# EAGLE design USB_SAO (EAGLE 9.3.1)
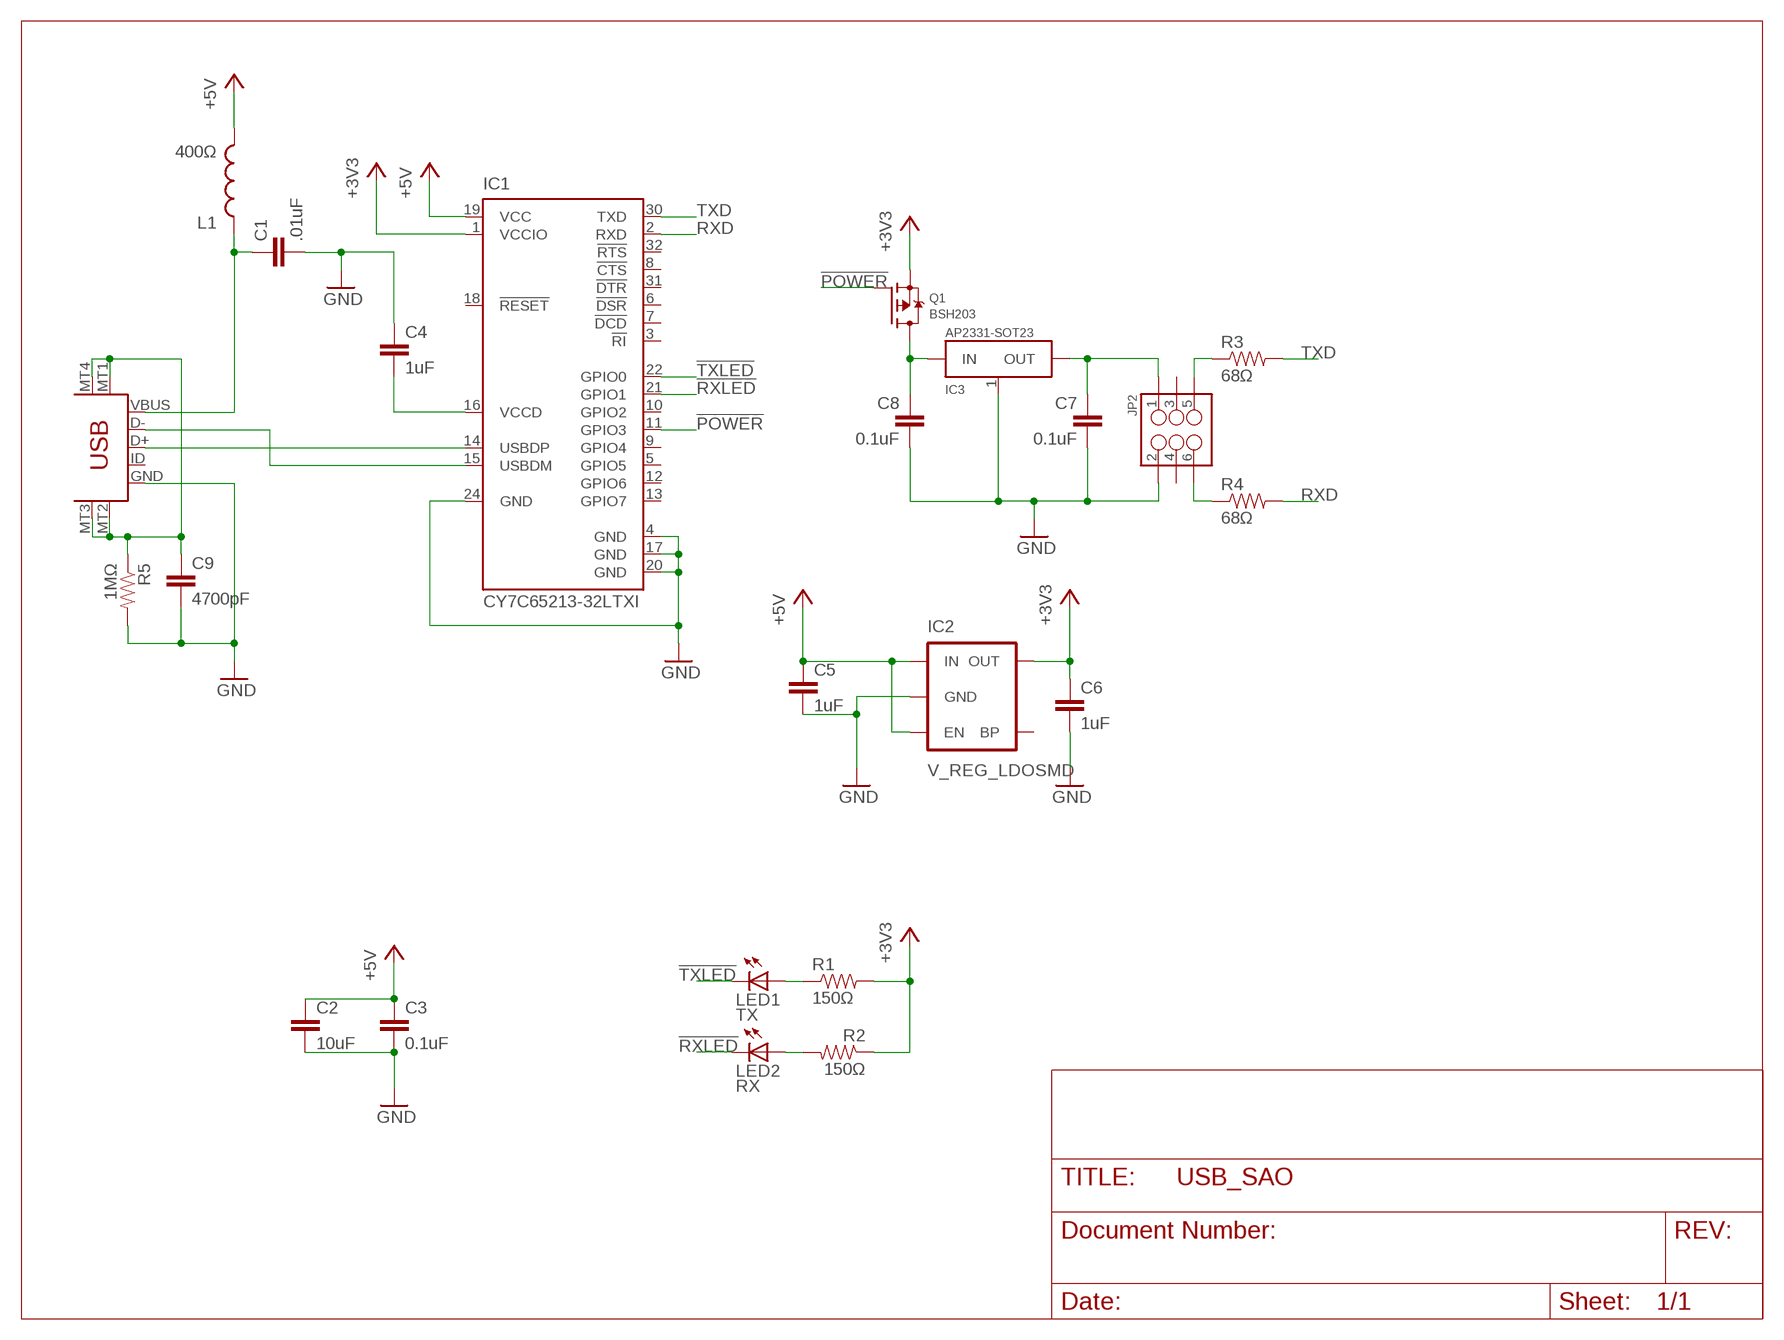
[diagram p0: schematic, sheet 1]

## Parts
C1  .01uF  CAP0805  [0805]
C2  10uF  CAP0805  [0805]
C3  0.1uF  CAP0805  [0805]
C4  1uF  CAP0805  [0805]
C5  1uF  CAP0805  [0805]
C6  1uF  CAP0805  [0805]
C7  0.1uF  CAP0805  [0805]
C8  0.1uF  CAP0805  [0805]
C9  4700pF  CAP0805  [0805]
IC1  CY7C65213-32LTXI  [QFN32]
IC2  V_REG_LDOSMD  [SOT23-5]
IC3  AP2331-SOT23  [SOT23-3]
JP1  USB-5PIN-MICROB  [USB-MICROB]
JP2  M03X2NO_SILK  [2X3-NS]
L1  400Ω  INDUCTOR0805  [0805]
LED1  TX  LEDCHIP-LED0805  [CHIP-LED0805]
LED2  RX  LEDCHIP-LED0805  [CHIP-LED0805]
Q1  BSH203  MOSFET-P  [SOT23-R]
R1  150Ω  RESISTOR0805-RES  [0805]
R2  150Ω  RESISTOR0805-RES  [0805]
R3  68Ω  RESISTOR0805-RES  [0805]
R4  68Ω  RESISTOR0805-RES  [0805]
R5  1MΩ  RESISTOR0805-RES  [0805]

## Nets
!POWER: IC1.11(GPIO3) Q1.1(G)
!RXLED: IC1.21(GPIO1) LED2.C
!TXLED: IC1.22(GPIO0) LED1.C
+3V3: C6.1 IC1.1(VCCIO) IC2.5(OUT) Q1.2(S) R1.2 R2.1
+5V: C2.1 C3.1 C5.1 IC1.19(VCC) IC2.1(IN) IC2.3(EN) L1.2
GND: C1.2 C2.2 C3.2 C4.1 C5.2 C6.2 C7.2 C8.2 C9.2 IC1.4(GND) IC1.17(GND) IC1.20(GND) IC1.24(GND) IC2.2(GND) IC3.1(GND) JP1.GND JP2.2 R5.2
N$1: IC1.14(USBDP) JP1.D+
N$2: IC1.15(USBDM) JP1.D-
N$3: LED1.A R1.1
N$4: LED2.A R2.2
N$5: JP2.5 R3.1
N$6: C1.1 JP1.VBUS L1.1
N$7: JP2.6 R4.1
N$9: C7.1 IC3.2(OUT) JP2.1
N$10: C8.1 IC3.3(IN) Q1.3(D)
N$11: C9.1 JP1.MT1(MTN1) JP1.MT2(MTN3) JP1.MT3(MTN4) JP1.MT4(MTN2) R5.1
N$17: C4.2 IC1.16(VCCD)
RXD: IC1.2(RXD) R4.2
TXD: IC1.30(TXD) R3.2
Unconnected: IC1.3(!RI) IC1.5(GPIO5) IC1.6(!DSR) IC1.7(!DCD) IC1.8(!CTS) IC1.9(GPIO4) IC1.10(GPIO2) IC1.12(GPIO6) IC1.13(GPIO7) IC1.18(!RESET) IC1.31(!DTR) IC1.32(!RTS) IC2.4(BP) JP1.ID JP2.3 JP2.4

## Library data of the parts
C1-C9 = SparkFun-Capacitors:CAP: Capacitor Standard 0603 ceramic capacitor, and 0.1" leaded capacitor.
IC1 = ftdichip:CY7C65213-32LTXI
IC2 = SparkFun-PowerIC:V_REG_LDO: Voltage Regulator LDO Standard 150mA LDO voltage regulator in SOT-23 layout. Micrel part MIC5205. BP (by-pass) pin is used to lower output noise with 470pF cap.
IC3 = AP2331:AP2331-SOT23
JP1 = SparkFun-Connectors:USB-5PIN: Mini-USB "B" connector with 5th pin broken out. Created new symbol breaking out 5th "ID" pin in mini/micro USB connector spec. See: http://en.wikipedia.org/wiki/Mini_usb#Cables. Uses same footprint as 4-pin symbol. Also added pins to connect to mounting / shield pads if required (probably not generally needed as signals aren't shielded once they leave the connector).
JP2 = SparkFun-Connectors-new:M03X2: 2x3 .1" header. Shrouded, with keying- CONN-10681 SMT- CONN-11415 Pogo pins- HW-11044
L1 = SparkFun-Passives:INDUCTOR: Inductors Basic Inductor/Choke - 0603 and 1206. Footprints are not proven and vary greatly between part numbers. SRN6045- 33uH, 20% 1.4A
LED1 LED2 = led:LED: LED OSRAM: - CHIPLED LG R971, LG N971, LY N971, LG Q971, LY Q971, LO R971, LY R971 LH N974, LH R974 LS Q976, LO Q976, LY Q976 LO Q996 - Hyper CHIPLED LW Q18S LB Q993, LB Q99A, LB R99A - SideLED LS A670, LO A670, LY A670, LG A670, LP A670 LB A673, LV A673, LT A673, LW A673 LH A674 LY A675 LS A676, LA A676, LO A676, LY A676, LW A676 LS A679, LY A679, LG A679 - Hyper Micro SIDELED® LS Y876, LA Y876, LO Y876, LY Y876 LT Y87S - SmartLED LW L88C, LW L88S LB L89C, LB L89S, LG L890 LS L89K, LO L89K, LY L89K LS L896, LA L896, LO L896, LY L896 - TOPLED LS T670, LO T670, LY T670, LG T670, LP T670 LSG T670, LSP T670, LSY T670, LOP T670, LYG T670 LG T671, LOG T671, LSG T671 LB T673, LV T673, LT T673, LW T673 LH T674 LS T676, LA T676, LO T676, LY T676, LB T676, LH T676, LSB T676, LW T676 LB T67C, LV T67C, LT T67C, LS T67K, LO T67K, LY T67K, LW E67C LS E67B, LA E67B, LO E67B, LY E67B, LB E67C, LV E67C, LT E67C LW T67C LS T679, LY T679, LG T679 LS T770, LO T770, LY T770, LG T770, LP T770 LB T773, LV T773, LT T773, LW T773 LH T774 LS E675, LA E675, LY E675, LS T675 LS T776, LA T776, LO T776, LY T776, LB T776 LHGB T686 LT T68C, LB T68C - Hyper Mini TOPLED® LB M676 - Mini TOPLED Santana® LG M470 LS M47K, LO M47K, LY M47K Source: http://www.osram.convergy.de LUXEON: - LUMILED® LXK2-PW12-R00, LXK2-PW12-S00, LXK2-PW14-U00, LXK2-PW14-V00 LXK2-PM12-R00, LXK2-PM12-S00, LXK2-PM14-U00 LXK2-PE12-Q00, LXK2-PE12-R00, LXK2-PE12-S00, LXK2-PE14-T00, LXK2-PE14-U00 LXK2-PB12-K00, LXK2-PB12-L00, LXK2-PB12-M00, LXK2-PB14-N00, LXK2-PB14-P00, LXK2-PB14-Q00 LXK2-PR12-L00, LXK2-PR12-M00, LXK2-PR14-Q00, LXK2-PR14-R00 LXK2-PD12-Q00, LXK2-PD12-R00, LXK2-PD12-S00 LXK2-PH12-R00, LXK2-PH12-S00 LXK2-PL12-P00, LXK2-PL12-Q00, LXK2-PL12-R00 Source: www.luxeon.com KINGBRIGHT: KA-3528ASYC Source: www.kingbright.com
Q1 = microbuilder:MOSFET-P: P-Channel Mosfet LEGEND VDS: Voltage Drain-Source ID: Drain Current RDS(ON): Drain-Source On-State Resistance VGS(TH): Gate-Source Threshold Voltage CISS: Drain-Source Input Capacitance SOT-23 Name VDS ID RDS(ON) VGS(TH) CISS Order Number IRLML5103 30V 760mA 600 mOhm -- 75pF @ 25V Digikey: IRLML5103PBFCT-ND IRLML6401 12V 4.3A 50 mOhm 950mV @ 250µA 830pF @ 10V Digikey: IRLML6401PBFTR-ND NTR0202PL 20V 400mA 800 mOhm 2.3V @ 250uA 70pF @ 5V Digikey: NTR0202PLT1GOSTR-ND NTR4101PT1G 20V 1.8A 85 mOhm 1.2V @ 250uA 675pF @ 10V Digikey: NTR4101PT1GOSCT-ND DMP2004K 20V 600mA 900 mOhm 1V @ 250uA 175pF @ 16V Digikey: DMP2004KDICT-ND PMV65XP 20V 3.9A 76 mOhm 950mV @ 1mA 725pF @ 20V Digikey: 568-2358-2-ND TO-252 Name VDS ID RDS(ON) VGS(TH) CISS Order Number AOD417 30V 25A 34 mOhm 3V @ 250µA 920pF @ 15V Digikey: 785-1106-2-ND
R1-R5 = SparkFun-Resistors:RESISTOR: Resistor Basic schematic elements and footprints for 0603, 1206, and PTH resistors.

## Board
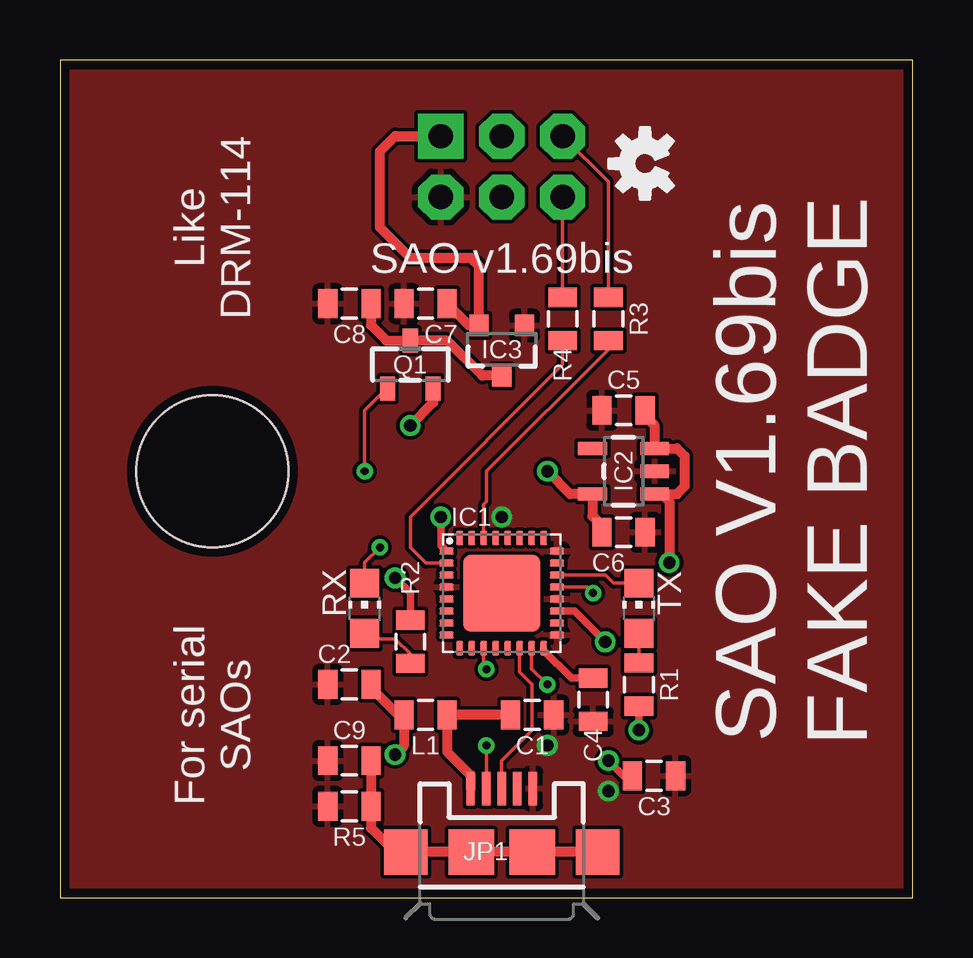
[diagram p1: board, top side]
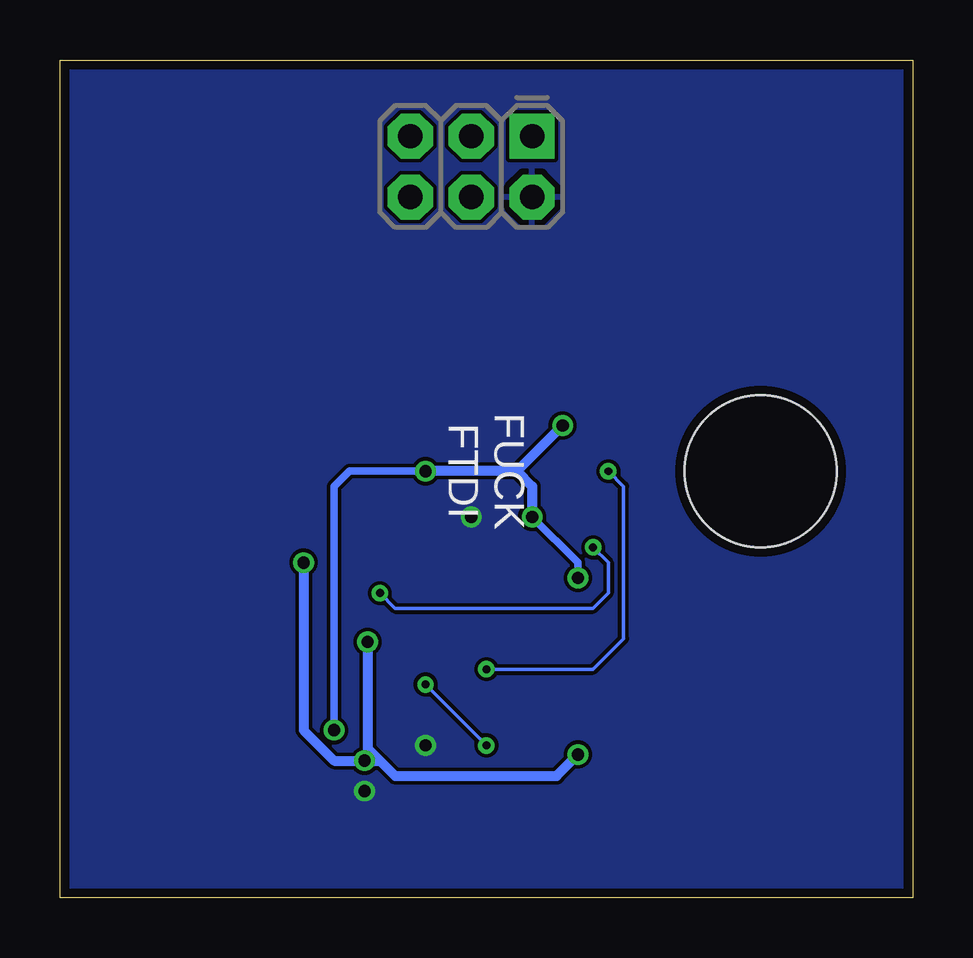
[diagram p2: board, bottom side, seen from below]

Size 35.56 x 34.92 mm. Coordinates in mm from the lower left corner, seen from the top.
Outline: 35.56,0 35.56,34.92 0,34.92 0,0 35.56,0
Copper layers (1*16): Top 0.0356mm / dielectric 1.5011mm / Bottom 0.0356mm
Design rules "LaenPCBOrder *": minimum track width 6mil, minimum drill 13mil, track to track 6mil, track to pad 6mil, pad to pad 6mil, via to via 6mil, smd to smd 6mil, copper to edge 15mil, drill to drill 6mil, minimum pad ring 7mil, minimum via ring 7mil, stop-mask expansion 4mil, vias tented up to drill 20mil, thermal gap 10mil
Holes 6.35 mm at 6.35,17.78

### Footprints (pad centres in the part's own frame; a part is rotated, then mirrored left to right if it is on the bottom)
0805 = smd 0.8 x 1.2: 1 -0.9,0; 2 0.9,0
QFN32 = smd 0.6 x 0.3: 1 -2.3,1.75; 2 -2.3,1.25; 3 -2.3,0.75; 4 -2.3,0.25; 5 -2.3,-0.25; 6 -2.3,-0.75; 7 -2.3,-1.25; 8 -2.3,-1.75; 17 2.3,-1.75; 18 2.3,-1.25; 19 2.3,-0.75; 20 2.3,-0.25; 21 2.3,0.25; 22 2.3,0.75; 23 2.3,1.25; 24 2.3,1.75 | smd 0.3 x 0.6: 9 -1.75,-2.3; 10 -1.25,-2.3; 11 -0.75,-2.3; 12 -0.25,-2.3; 13 0.25,-2.3; 14 0.75,-2.3; 15 1.25,-2.3; 16 1.75,-2.3; 25 1.75,2.3; 26 1.25,2.3; 27 0.75,2.3; 28 0.25,2.3; 29 -0.25,2.3; 30 -0.75,2.3; 31 -1.25,2.3; 32 -1.75,2.3 | smd 3.2 x 3.2: EXP 0,0
SOT23-5 = smd 0.55 x 1.2: 1 -0.95,-1.3; 2 0,-1.3; 3 0.95,-1.3; 4 0.95,1.3; 5 -0.95,1.3
SOT23-3 = smd 0.8 x 0.9: 1 -0.95,-1; 2 0.95,-1; 3 0,1.1
USB-MICROB = smd 0.35 x 1.4: D+ 0,2.65; D- -0.65,2.65; GND 1.3,2.65; ID 0.65,2.65; VBUS -1.3,2.65 | smd 1.8 x 1.9: MT1 -4,0; MT4 4,0 | smd 1.9 x 1.9: MT2 -1.27,0; MT3 1.27,0
2X3-NS = drill 1.016 pad 1.88 square: 1 -2.54,-1.27 | drill 1.016 pad 1.88 octagon: 2 -2.54,1.27; 3 0,-1.27; 4 0,1.27; 5 2.54,-1.27; 6 2.54,1.27
CHIP-LED0805 = smd 1.2 x 1.2: A 0,-1.05; C 0,1.05
SOT23-R = smd 0.635 x 1.016: 1 -0.95,-1; 2 0.95,-1; 3 0,1

### Placement (x,y rotation side)
C1  19.68,7.62 0 top
C2  12.06,8.89 180 top
C3  24.77,5.08 0 top
C4  22.23,8.26 90 top
C5  23.5,20.32 180 top
C6  23.5,15.24 0 top
C7  15.24,24.77 180 top
C8  12.06,24.77 180 top
C9  12.06,5.71 180 top
IC1  18.41,12.7 0 top
IC2  23.5,17.78 90 top
IC3  18.41,22.86 180 top
JP1  18.41,1.91 0 top
JP2  18.41,30.48 180 bottom
L1  15.24,7.62 180 top
LED1  24.13,12.06 0 top
LED2  12.7,12.06 0 top
Q1  14.61,22.23 0 top
R1  24.13,8.89 270 top
R2  14.61,10.67 270 top
R3  22.86,24.13 270 top
R4  20.95,24.13 270 top
R5  12.06,3.81 180 top
U$1  [OSHW-LOGO-S]  24.38,30.61 90 top

### Tracks (layer width: path | path; a pad name or v marks a point on that pad's centre or on a via)
!POWER  (via drill 0.33)
  Top 0.152: IC1.11 17.66,9.64 v17.78,9.53 | v12.7,17.78 12.7,20.32 13.61,21.23 Q1.1
  Bottom 0.152: v17.78,9.53 13.34,9.53 12.06,10.79 12.06,17.14 v12.7,17.78
!RXLED  (via drill 0.33)
  Top 0.152: IC1.21 21.98,12.95 v22.23,12.7 | LED2.C 12.7,13.97 v13.34,14.61
  Bottom 0.152: v22.23,12.7 21.59,12.06 13.34,12.06 12.7,12.7 12.7,13.97 v13.34,14.61
!TXLED
  Top 0.152: LED1.C 23.08,13.12 22.75,13.45 IC1.22
+3V3  (via drill 0.51)
  Top 0.305: R1.2 v24.13,6.99 | R2.1 14.61,12.7 v13.97,13.34 | IC1.1 15.88,14.69 v15.88,15.88
  Top 0.406: C6.1 22.59,15.51 22.2,15.9 IC2.5 21.27,16.83 v20.32,17.78 | Q1.2 15.55,20.64 v14.61,19.68
  Bottom 0.305: v13.97,13.34 13.97,13.97 v15.88,15.88 | v24.13,6.99 24.13,17.14 23.5,17.78 v20.32,17.78
  Bottom 0.406: v14.61,19.68 16.51,17.78 | 16.51,17.78 v20.32,17.78 | 16.51,17.78 15.88,17.14 v15.88,15.88
+5V  (via drill 0.51)
  Top 0.305: v22.73,10.67 21.45,11.95 IC1.19 | C3.1 23.5,5.08 v22.86,5.71
  Top 0.406: C2.1 12.96,8.75 14.1,7.62 L1.2 14.34,6.34 v13.97,5.97 | C5.1 24.39,20.05 24.8,19.66 IC2.3 25.72,18.73 26.04,18.41 26.04,17.14 25.72,16.83 IC2.1 25.08,16.83 25.4,16.51 v25.4,13.97
  Bottom 0.406: 22.23,5.71 21.59,5.08 14.86,5.08 v13.97,5.97 | v25.4,13.97 25.4,6.99 24.13,5.71 v22.86,5.71 22.23,5.71 | v22.73,10.67 22.73,6.22 22.23,5.71
GND  (via drill 0.51)
  other vias: 22.86,4.45 20.32,6.35 18.41,15.88
  pour Top: 35.56,0 0,0 0,34.92 35.56,34.92
  pour Bottom: 35.56,0 0,0 0,34.92 35.56,34.92
N$1
  Top 0.152: JP1.D+ 18.41,5.71 19.68,6.99 19.68,8.89 19.16,9.41 IC1.14
N$2  (via drill 0.33)
  Top 0.152: v20.32,8.89 19.66,9.54 IC1.15 | v17.78,6.35 17.78,4.57 JP1.D-
  Bottom 0.152: v20.32,8.89 v17.78,6.35
N$3
  Top 0.152: R1.1 LED1.A
N$4
  Top 0.152: R2.2 14.61,10.16 13.97,10.79 12.92,10.79 LED2.A
N$5
  Top 0.152: R3.1 22.86,29.84 JP2.5
N$6
  Top 0.406: C1.1 L1.1 16.14,6.08 17.11,5.11 JP1.VBUS
N$7
  Top 0.152: R4.1 JP2.6
N$9
  Top 0.406: C7.1 17.05,23.86 IC3.2 17.46,26.35 17.14,26.67 14.61,26.67 13.34,27.94 13.34,31.11 13.97,31.75 JP2.1
N$10
  Top 0.406: IC3.3 17.61,21.76 16.14,23.23 Q1.3 13.61,23.23 12.96,23.86 C8.1
N$11
  Top 0.406: C9.1 R5.1 12.96,2.91 13.97,1.91 JP1.MT1 JP1.MT2 JP1.MT3 JP1.MT4
N$17
  Top 0.305: C4.2 21.32,9.15 20.16,10.31 IC1.16
RXD
  Top 0.152: IC1.2 15.26,13.95 14.61,14.61 14.61,15.88 20.95,22.23 R4.2
TXD
  Top 0.152: IC1.30 17.66,16.39 17.78,16.51 17.78,17.78 22.86,22.86 R3.2

### Text on the board
tNames: Like / DRM-114 | SAO v1.69bis | SAO V1.69bis / FAKE BADGE | For serial / SAOs
bNames: FUCK / FTDI